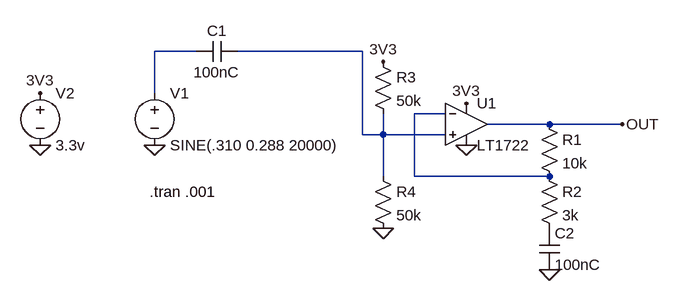
[diagram p0: schematic first test.asc]
first test.asc, the LTspice schematic file:
Version 4
SHEET 1 880 680
WIRE -128 256 -192 256
WIRE 128 256 -64 256
WIRE -192 320 -192 256
WIRE 256 352 208 352
WIRE 416 368 320 368
WIRE 528 368 416 368
WIRE 128 384 128 256
WIRE 160 384 160 352
WIRE 160 384 128 384
WIRE 256 384 160 384
WIRE 160 448 160 384
WIRE 208 448 208 352
WIRE 416 448 208 448
FLAG -192 400 0
FLAG -368 400 0
FLAG -368 320 3V3
FLAG 288 336 3V3
FLAG 288 400 0
FLAG 528 368 OUT
FLAG 416 592 0
FLAG 160 272 3V3
FLAG 160 528 0
SYMBOL voltage -192 304 R0
SYMATTR InstName V1
SYMATTR Value SINE(.310 0.288 20000)
SYMATTR Value2 AC .288 0
SYMATTR SpiceLine Rser=0
SYMBOL voltage -368 304 R0
SYMATTR InstName V2
SYMATTR Value 3.3v
SYMATTR SpiceLine Rser=0
SYMBOL res 400 352 R0
SYMATTR InstName R1
SYMATTR Value 10k
SYMBOL res 400 432 R0
SYMATTR InstName R2
SYMATTR Value 3k
SYMBOL cap -64 240 R90
WINDOW 0 0 32 VBottom 2
WINDOW 3 32 32 VTop 2
SYMATTR InstName C1
SYMATTR Value 100nC
SYMBOL res 144 256 R0
SYMATTR InstName R3
SYMATTR Value 50k
SYMBOL res 144 432 R0
SYMATTR InstName R4
SYMATTR Value 50k
SYMBOL cap 400 528 R0
SYMATTR InstName C2
SYMATTR Value 100nC
SYMBOL Opamps/LT1722 288 304 R0
SYMATTR InstName U1
TEXT -200 472 Left 2 !.tran .001

The netlist it stands for:
* first test.asc
V1 N001 0 SINE(.310 0.288 20000) AC .288 0 Rser=0
V2 3V3 0 3.3v Rser=0
R1 OUT N003 10k
R2 N003 P001 3k
C1 N002 N001 100nC
R3 3V3 N002 50k
R4 N002 0 50k
C2 P001 0 100nC
XU1 N002 N003 3V3 0 OUT LT1722  ; pins In+ In- V+ V- OUT
.tran .001
.backanno
.end